# Altium schematic sheet DrivePowerModule.SchDoc
size A
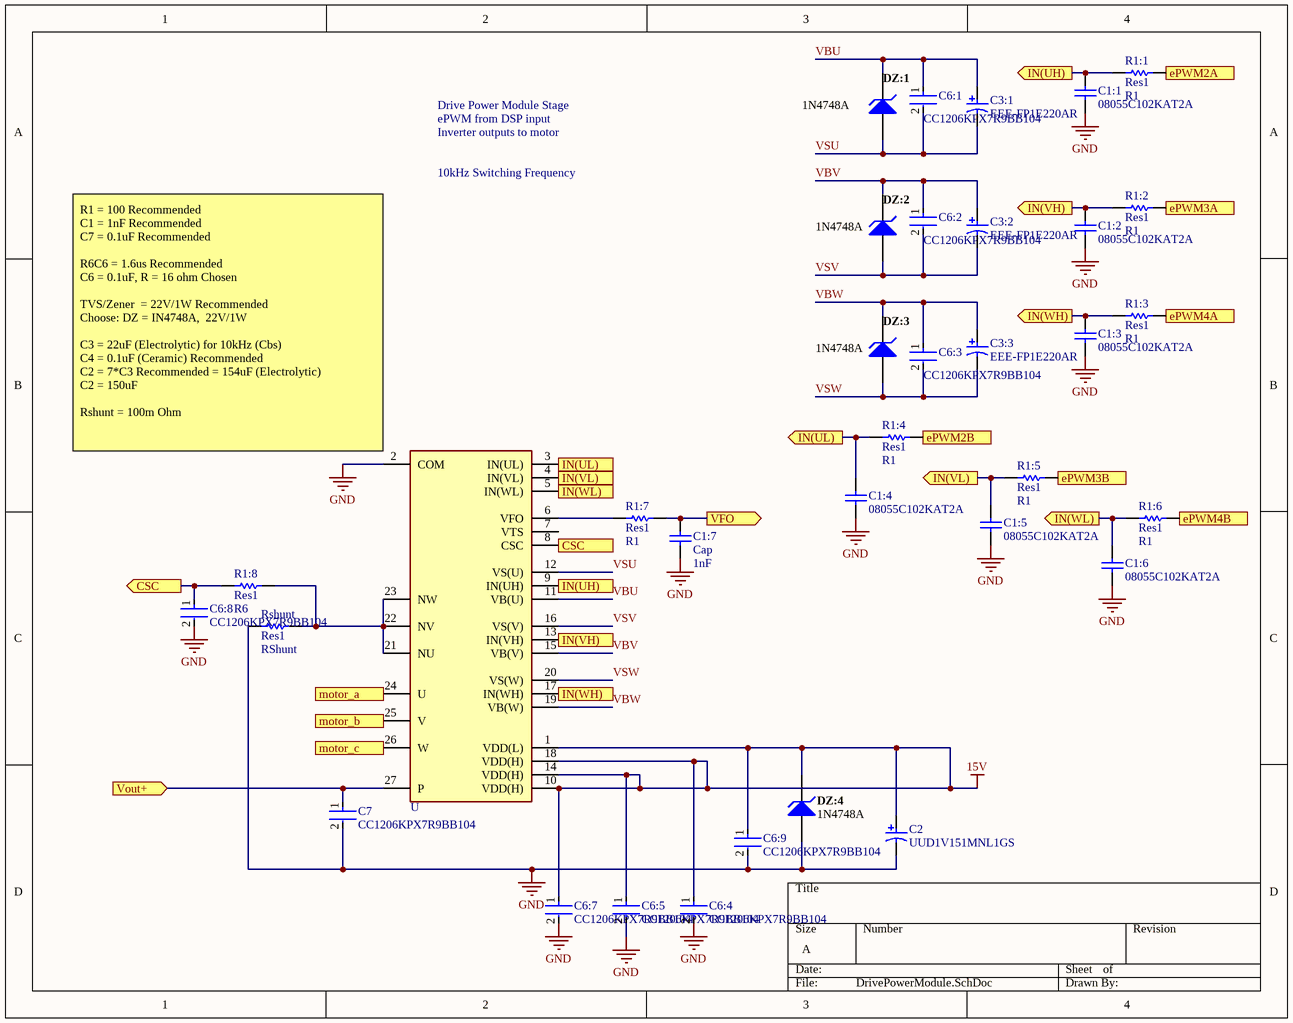
[diagram p0: DrivePowerModule.SchDoc]

## Parts
C1:1  08055C102KAT2A  [CAPC2013X94X50ML20T25]
C1:2  08055C102KAT2A  [CAPC2013X94X50ML20T25]
C1:3  08055C102KAT2A  [CAPC2013X94X50ML20T25]
C1:4  08055C102KAT2A  [CAPC2013X94X50ML20T25]
C1:5  08055C102KAT2A  [CAPC2013X94X50ML20T25]
C1:6  08055C102KAT2A  [CAPC2013X94X50ML20T25]
C1:7  Cap  value 1nF  [RAD-0.3]
C2  UUD1V151MNL1GS  [NIC-CAPA2-8X10_V]
C3:1  EEE-FP1E220AR  [PNSC-FP-V-C_V]
C3:2  EEE-FP1E220AR  [PNSC-FP-V-C_V]
C3:3  EEE-FP1E220AR  [PNSC-FP-V-C_V]
C6:1  CC1206KPX7R9BB104  [FP-CC1206-1_25-MFG]
C6:2  CC1206KPX7R9BB104  [FP-CC1206-1_25-MFG]
C6:3  CC1206KPX7R9BB104  [FP-CC1206-1_25-MFG]
C6:4  CC1206KPX7R9BB104  [FP-CC1206-1_25-MFG]
C6:5  CC1206KPX7R9BB104  [FP-CC1206-1_25-MFG]
C6:7  CC1206KPX7R9BB104  [FP-CC1206-1_25-MFG]
C6:8  CC1206KPX7R9BB104  [FP-CC1206-1_25-MFG]
C6:9  CC1206KPX7R9BB104  [FP-CC1206-1_25-MFG]
C7  CC1206KPX7R9BB104  [FP-CC1206-1_25-MFG]
DZ:1  1N4748A  [FAIR-DO-41-2_V]
DZ:2  1N4748A  [FAIR-DO-41-2_V]
DZ:3  1N4748A  [FAIR-DO-41-2_V]
DZ:4  1N4748A  [FAIR-DO-41-2_V]
R1:1  Res1  value R1  [AXIAL-0.3]
R1:2  Res1  value R1  [AXIAL-0.3]
R1:3  Res1  value R1  [AXIAL-0.3]
R1:4  Res1  value R1  [AXIAL-0.3]
R1:5  Res1  value R1  [AXIAL-0.3]
R1:6  Res1  value R1  [AXIAL-0.3]
R1:7  Res1  value R1  [AXIAL-0.3]
R1:8  Res1  value R6  [AXIAL-0.3]
Rshunt  Res1  value RShunt  [AXIAL-0.3]
U  FNB34060T  [FNB34060T]  (value not drawn)

## Ports
CSC (in), CSC (out), ePWM2A (in), ePWM2B (in), ePWM3A (in), ePWM3B (in), ePWM4A (in), ePWM4B (in), IN(UH) (in), IN(UH) (out), IN(UL) (in), IN(UL) (out), IN(VH) (in), IN(VH) (out), IN(VL) (in), IN(VL) (out), IN(WH) (in), IN(WH) (out), IN(WL) (in), IN(WL) (out), motor_a (out), motor_b (out), motor_c (out), VFO (out), Vout+ (in)

## Nets
15V: C2.1 C6:4.1 C6:5.1 C6:7.1 C6:9.1 DZ:4.2(K) U.1(VDD(L)) U.10(VDD(H)) U.14(VDD(H)) U.18(VDD(H))
GND: C1:1.2 C1:2.2 C1:3.2 C1:4.2 C1:5.2 C1:6.2 C1:7.1 C2.2 C6:4.2 C6:5.2 C6:7.2 C6:8.2 C6:9.2 C7.2 DZ:4.1(A) Rshunt.1 U.2(COM)
CSC: C6:8.1 R1:8.1 U.8(CSC) ; port CSC
ePWM2A: R1:1.2 ; port ePWM2A
ePWM2B: R1:4.2 ; port ePWM2B
ePWM3A: R1:2.2 ; port ePWM3A
ePWM3B: R1:5.2 ; port ePWM3B
ePWM4A: R1:3.2 ; port ePWM4A
ePWM4B: R1:6.2 ; port ePWM4B
IN(UH): C1:1.1 R1:1.1 U.9(IN(UH)) ; port IN(UH)
IN(UL): C1:4.1 R1:4.1 U.3(IN(UL)) ; port IN(UL)
IN(VH): C1:2.1 R1:2.1 U.13(IN(VH)) ; port IN(VH)
IN(VL): C1:5.1 R1:5.1 U.4(IN(VL)) ; port IN(VL)
IN(WH): C1:3.1 R1:3.1 U.17(IN(WH)) ; port IN(WH)
IN(WL): C1:6.1 R1:6.1 U.5(IN(WL)) ; port IN(WL)
motor_a: U.24(U) ; port motor_a
motor_b: U.25(V) ; port motor_b
motor_c: U.26(W) ; port motor_c
VBU: C3:1.1 C6:1.1 DZ:1.2(K) U.11(VB(U))
VBV: C3:2.1 C6:2.1 DZ:2.2(K) U.15(VB(V))
VBW: C3:3.1 C6:3.1 DZ:3.2(K) U.19(VB(W))
VFO: C1:7.2 R1:7.2 ; port VFO
Vout+: C7.1 U.27(P) ; port Vout+
VSU: C3:1.2 C6:1.2 DZ:1.1(A) U.12(VS(U))
VSV: C3:2.2 C6:2.2 DZ:2.1(A) U.16(VS(V))
VSW: C3:3.2 C6:3.2 DZ:3.1(A) U.20(VS(W))
NetR1:7_1: R1:7.1 U.6(VFO)
NetR1:8_2: R1:8.2 Rshunt.2 U.21(NU) U.22(NV) U.23(NW)

Not connected (* = marked no-connect by the designer): U 7(VTS)

## Notes on the sheet
- Drive Power Module Stage
- ePWM from DSP input
- Inverter outputs to motor
- 10kHz Switching Frequency
- (near U) R1 = 100 Recommended
  C1 = 1nF Recommended
  C7 = 0.1uF Recommended
  R6C6 = 1.6us Recommended
  C6 = 0.1uF, R = 16 ohm Chosen
  TVS/Zener  = 22V/1W Recommended
  Choose: DZ = IN4748A,  22V/1W
  C3 = 22uF (Electrolytic) for 10kHz (Cbs)
  C4 = 0.1uF (Ceramic) Recommended
  C2 = 7*C3 Recommended = 154uF (Electrolytic)
  C2 = 150uF
  Rshunt = 100m Ohm

## Library data of the parts
C1:1-C1:6 = CMP-1036-02979-2: 1nF Ceramic Cap 50V; Part Number: 08055C102KAT2A.; Manufacturer: AVX Interconnect / Elco
C1:7 = Cap: Capacitor; Published: 8-Jun-2000; LatestRevisionDate: 17-Jul-2002; LatestRevisionNote: Re-released for DXP Platform.; PackageReference: RAD-0.3; Publisher: Altium Limited; PackageDescription: Radial Cap, Thru-Hole; 2 Leads; 0.3 in Pin Spacing
C2 = CMP-0687-00078-1: Aluminum Electrolytic Capacitor, UD Series, Low Impedance, 150 uF, 35 V, + / - 20%, -55 to 105 degC, Chip Type, 8 x 10 mm D x L, Pb-Free, Reel; Manufacturer: Nichicon; Endurance Time: 5000 h; Tolerance Rated Capacitance: -20 to 20%; Rated Capacitance: 150 uF; Packing: Dia382mm Reel; Rated Ripple Current (at 100kHz): 450 mA; Impedance: 0.17 Ohm; Rated Voltage: 35 V; RoHS: TRUE; ComponentLink3Description: Package Specification; DatasheetVersion: 08/2012; PackageDescription: 2-Pin Surface Mount Device, Diameter 8 mm, Height 10 mm, Pitch 6.5 mm; Diameter: 8 mm; PartNumber: UUD1V151MNL1GS; Mounting Technology: Surface Mount; PackageReference: CAPAE-D8H10; ComponentLink3URL: http://products.nichicon.co.jp/en/pdf/XJA043/e-ud.pdf; ComponentLink2Description: Datasheet; ComponentLink1Description: Manufacturer URL; ComponentLink1URL: http://www.nichicon.co.jp/; ComponentLink2URL: http://products.nichicon.co.jp/en/pdf/XJA043/e-ud.pdf; Length: 10 mm
C3:1-C3:3 = CMP-2000-06213-1: Aluminum Electrolytic Capacitor, 22 uF, +/- 20%, 25 V, 2-Pin SMD (Size Code C), -55 to 105 degC, RoHS, Tape and Reel; Manufacturer: Panasonic; ESR (Equivalent Series Resistance): 0.36O; Ripple Current: 240mA; Capacitance: 22µF; Lifetime@Temperature: 2000Hrs@105°C; Rated Voltage: 25V; Type: Can; Package Reference: FP-V-C; Package Description: 2-Pin Electrolytic Aluminum Capacitor, Body 5.3 x 5.3 mm; Operating Temp Range: -55to+105°C; Mounting Technology: SurfaceMount; Datasheet URL: http://industrial.panasonic.com/cdbs/www-data/pdf/RDE0000/ABA0000C1184.pdf; Case Size/Dimension: Ø5x5.8mm; Operating Temp-Max: 105°C; Package URL: http://industrial.panasonic.com/cdbs/www-data/pdf/RDE0000/DME0000COL48.pdf; Datasheet Version: 03/2016; Series: FP; Manufacturer URL: http://www.panasonic.com/
C6:1-C6:5 C6:7-C6:9 C7 = CMP-03422-000130-1: CC1206 100 nF X7R 10.00%50 V; Manufacturer: Yageo; Capacitance: 100 nF; Tolerance: 0.1; Value: 100 nF; Temperature Coefficient: 15%; Material: Ceramic; Voltage Rating: 50 V; Automotive Grade: NA; Octopart: https://octopart.com/cc1206kpx7r9bb104-yageo-16251820; Footprint Url: http://www.yageo.com/exep/pages/download/literatures/UPY-C_GEN_24.pdf; ComponentLink2Description: Datasheet; Temperature Range Low: -55°C; Temperature: -55°C to +125°C; RoHS: TRUE; Mouser Description: Surface Mount Ceramic Multilayer Capacitor 0.1uF 10% X7R 50V 1206 Paper T/R; Device Class L1: Passive Components; Height: 1.45mm; Device Class L3: Ceramic Capacitors; Manufacturer Part Number: CC1206KPX7R9BB104; Temperature Characteristic: X7R; Device Class L2: Capacitors; Package: CC1206-1.25; Category: Cap; Lead Free: Yes; Automotive: No; ComponentLink2URL: http://www.yageo.com/documents/recent/UPY-NP0X7R_HV_1KV-to-3KV_11.pdf; Temperature Range High: +125°C
DZ:1-DZ:4 = CMP-0892-00021-1: Zener Diode, 22V, 1W, 5%, -65 to 200 degC, 2-Pin DO-41, Body 2.72 x 5.2 mm, RoHS; Manufacturer: Fairchild Semiconductor; VZ (Max.) (V): 23.1; IR (uA): 5; PD (W): 1; Test Current IZ (mA): 11.5; ZZ (Max) (ohm): 22; VZ (Min.) (V): 20.9; ComponentLink2Description: Datasheet; PartNumber: 1N4748A; Operating and Storage Temperature Range: -65 to 200 degC; PackageDescription: 2-Pin Axial leaded, Body 2.72 x 5.2 mm, Lead Spread 25.4 mm; ComponentLink3Description: Package Specification; RoHS: TRUE; PackageVersion: Rev. 2; ComponentLink1URL: http://www.fairchildsemi.com/; DatasheetVersion: Rev. H3; Mounting Technology: Through Hole; ComponentLink1Description: Manufacturer URL; ComponentLink3URL: http://www.fairchildsemi.com/dwg/DO/DO41A.pdf; PackageReference: DO-41-2; ComponentLink2URL: http://www.fairchildsemi.com/ds/1N/1N4744A.pdf; Tolerance: 5%
R1:1-R1:7 Rshunt = Res1: Resistor; Published: 8-Jun-2000; LatestRevisionDate: 17-Jul-2002; LatestRevisionNote: Re-released for DXP Platform.; PackageReference: AXIAL-0.3; Publisher: Altium Limited; PackageDescription: Axial Device, Thru-Hole; 2 Leads; 0.3 in Pin Spacing
R1:8 = Res1: 1/4W 16ohm Resistor; Published: 8-Jun-2000; LatestRevisionDate: 17-Jul-2002; LatestRevisionNote: Re-released for DXP Platform.; PackageReference: AXIAL-0.3; Publisher: Altium Limited; PackageDescription: Axial Device, Thru-Hole; 2 Leads; 0.3 in Pin Spacing